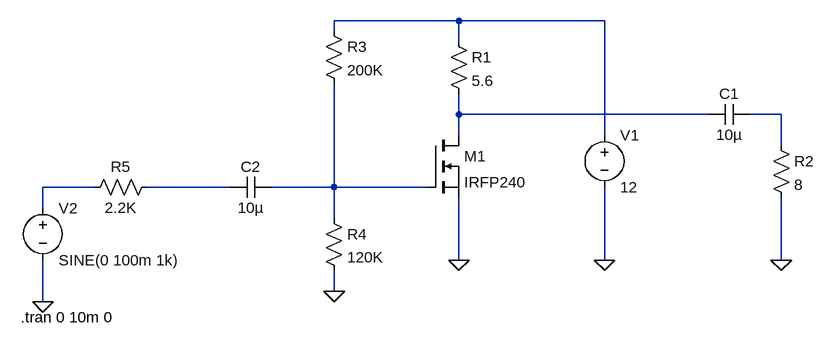
[diagram p0: schematic prubas.asc]
prubas.asc, the LTspice schematic file:
Version 4
SHEET 1 880 680
WIRE 208 -64 16 -64
WIRE 432 -64 208 -64
WIRE 16 -48 16 -64
WIRE 208 -32 208 -64
WIRE 208 80 208 48
WIRE 592 80 208 80
WIRE 704 80 656 80
WIRE 208 112 208 80
WIRE 432 112 432 -64
WIRE 704 128 704 80
WIRE -352 192 -432 192
WIRE -144 192 -272 192
WIRE 16 192 16 32
WIRE 16 192 -80 192
WIRE 160 192 16 192
WIRE -432 224 -432 192
WIRE 16 240 16 192
WIRE 208 304 208 208
WIRE 432 304 432 192
WIRE 704 304 704 208
WIRE 16 352 16 320
WIRE -432 368 -432 304
FLAG 208 304 0
FLAG 432 304 0
FLAG 704 304 0
FLAG 16 352 0
FLAG -432 368 0
SYMBOL nmos 160 112 R0
SYMATTR InstName M1
SYMATTR Value IRFP240
SYMBOL voltage 432 96 R0
WINDOW 123 0 0 Left 0
WINDOW 39 0 0 Left 0
SYMATTR InstName V1
SYMATTR Value 12
SYMBOL res 192 -48 R0
SYMATTR InstName R1
SYMATTR Value 5.6
SYMBOL cap 656 64 R90
WINDOW 0 0 32 VBottom 2
WINDOW 3 32 32 VTop 2
SYMATTR InstName C1
SYMATTR Value 10µ
SYMBOL res 688 112 R0
SYMATTR InstName R2
SYMATTR Value 8
SYMBOL res 0 -64 R0
SYMATTR InstName R3
SYMATTR Value 200K
SYMBOL res 0 224 R0
SYMATTR InstName R4
SYMATTR Value 120K
SYMBOL cap -80 176 R90
WINDOW 0 0 32 VBottom 2
WINDOW 3 32 32 VTop 2
SYMATTR InstName C2
SYMATTR Value 10µ
SYMBOL res -256 176 R90
WINDOW 0 0 56 VBottom 2
WINDOW 3 32 56 VTop 2
SYMATTR InstName R5
SYMATTR Value 2.2K
SYMBOL voltage -432 208 R0
WINDOW 123 0 0 Left 0
WINDOW 39 0 0 Left 0
SYMATTR InstName V2
SYMATTR Value SINE(0 100m 1k)
TEXT -466 392 Left 2 !.tran 0 10m 0

The netlist it stands for:
* prubas.asc
M1 N002 N006 0 0 IRFP240
V1 N001 0 12
R1 N001 N002 5.6
C1 N003 N002 10µ
R2 N003 0 8
R3 N001 N006 200K
R4 N006 0 120K
C2 N006 N005 10µ
R5 N005 N004 2.2K
V2 N004 0 SINE(0 100m 1k)
.model NMOS NMOS
.model PMOS PMOS
.lib standard.mos
.tran 0 10m 0
.backanno
.end